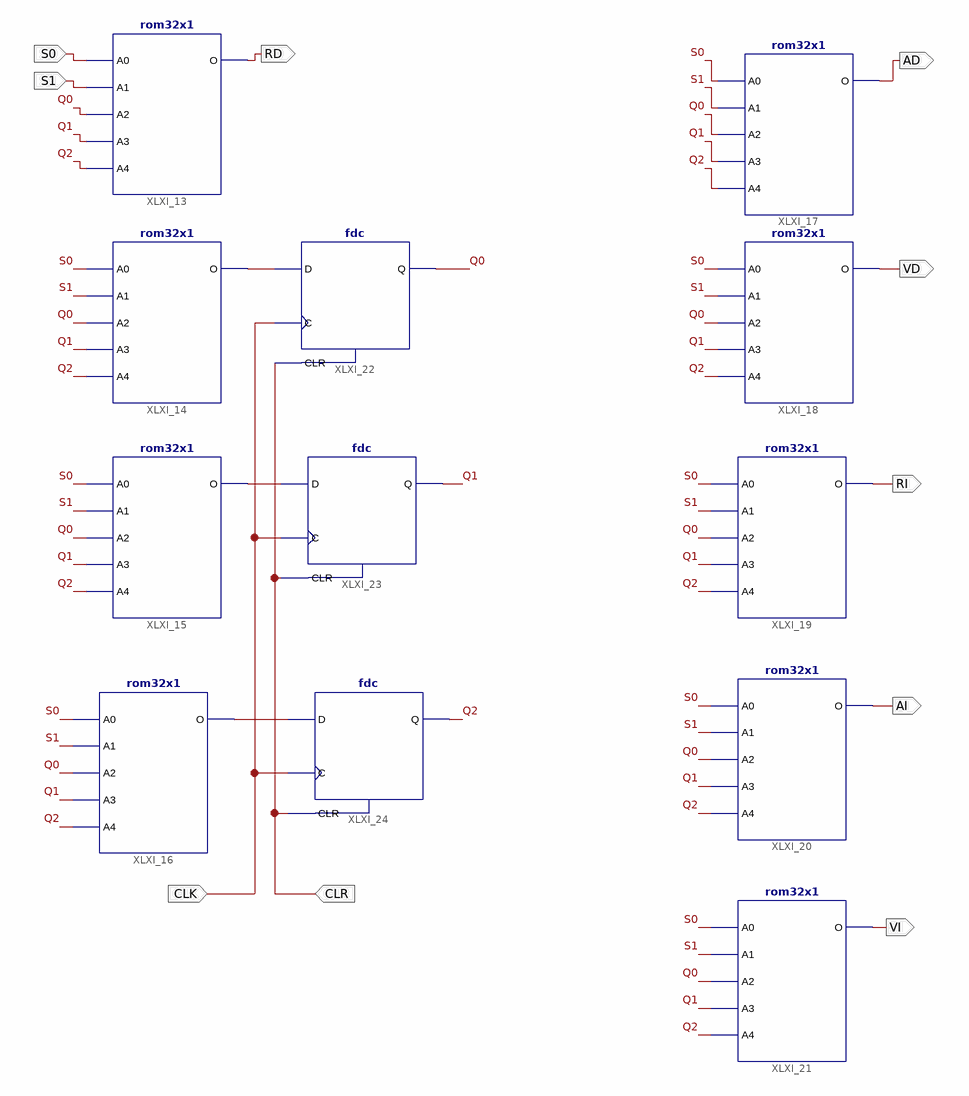
[diagram p0: schematic sheet 1]
// Xilinx ISE schematic p4ej2.sch (spartan3) as structural Verilog: 12 symbols, 10 ports
module p4ej2 (
  input  CLK,
  input  CLR,
  input  S0,
  input  S1,
  output RD,
  output AD,
  output VD,
  output RI,
  output VI,
  output AI
);

  wire Q0, Q1, Q2, XLXN_54, XLXN_55, XLXN_56;

  rom32x1 #(.INIT("ffff0000")) XLXI_13 (.A0(S0), .A1(S1), .A2(Q0), .A3(Q1), .A4(Q2), .O(RD));
  rom32x1 #(.INIT("0f0a0f0c")) XLXI_14 (.A0(S0), .A1(S1), .A2(Q0), .A3(Q1), .A4(Q2), .O(XLXN_54));
  rom32x1 #(.INIT("0ff00ff0")) XLXI_15 (.A0(S0), .A1(S1), .A2(Q0), .A3(Q1), .A4(Q2), .O(XLXN_55));
  rom32x1 #(.INIT("0ffff000")) XLXI_16 (.A0(S0), .A1(S1), .A2(Q0), .A3(Q1), .A4(Q2), .O(XLXN_56));
  rom32x1 #(.INIT("0000f000")) XLXI_17 (.A0(S0), .A1(S1), .A2(Q0), .A3(Q1), .A4(Q2), .O(AD));
  rom32x1 #(.INIT("00000fff")) XLXI_18 (.A0(S0), .A1(S1), .A2(Q0), .A3(Q1), .A4(Q2), .O(VD));
  rom32x1 #(.INIT("0000ffff")) XLXI_19 (.A0(S0), .A1(S1), .A2(Q0), .A3(Q1), .A4(Q2), .O(RI));
  rom32x1 #(.INIT("f0000000")) XLXI_20 (.A0(S0), .A1(S1), .A2(Q0), .A3(Q1), .A4(Q2), .O(AI));
  rom32x1 #(.INIT("0fff0000")) XLXI_21 (.A0(S0), .A1(S1), .A2(Q0), .A3(Q1), .A4(Q2), .O(VI));
  fdc XLXI_22 (.C(CLK), .CLR(CLR), .D(XLXN_54), .Q(Q0));
  fdc XLXI_23 (.C(CLK), .CLR(CLR), .D(XLXN_55), .Q(Q1));
  fdc XLXI_24 (.C(CLK), .CLR(CLR), .D(XLXN_56), .Q(Q2));
endmodule
